# Altium schematic sheet DCDC_int.SchDoc
size 420 x 297 mm; Address1: Address1; Address2: Address2; Address3: Address3; Address4: Address4; SheetNumber: 1; Scale: 1:1; Разраб.: Иванов; Обозначение документа: АБВГ.123456.001 Э3; Пров.: Петров; Утв.: Сидоров; Наименование организации: ОАО "Концерн "МПО-Гидроприбор"; Перв. применение: АБВГ.123456.000; Наименование изделия 1: Плата; Наименование изделия 2: Схема электрическая; Наименование изделия 3: принципиальная; Нач. отд.: Нач. отд.; Фамилия нач. отд.: Сидоров
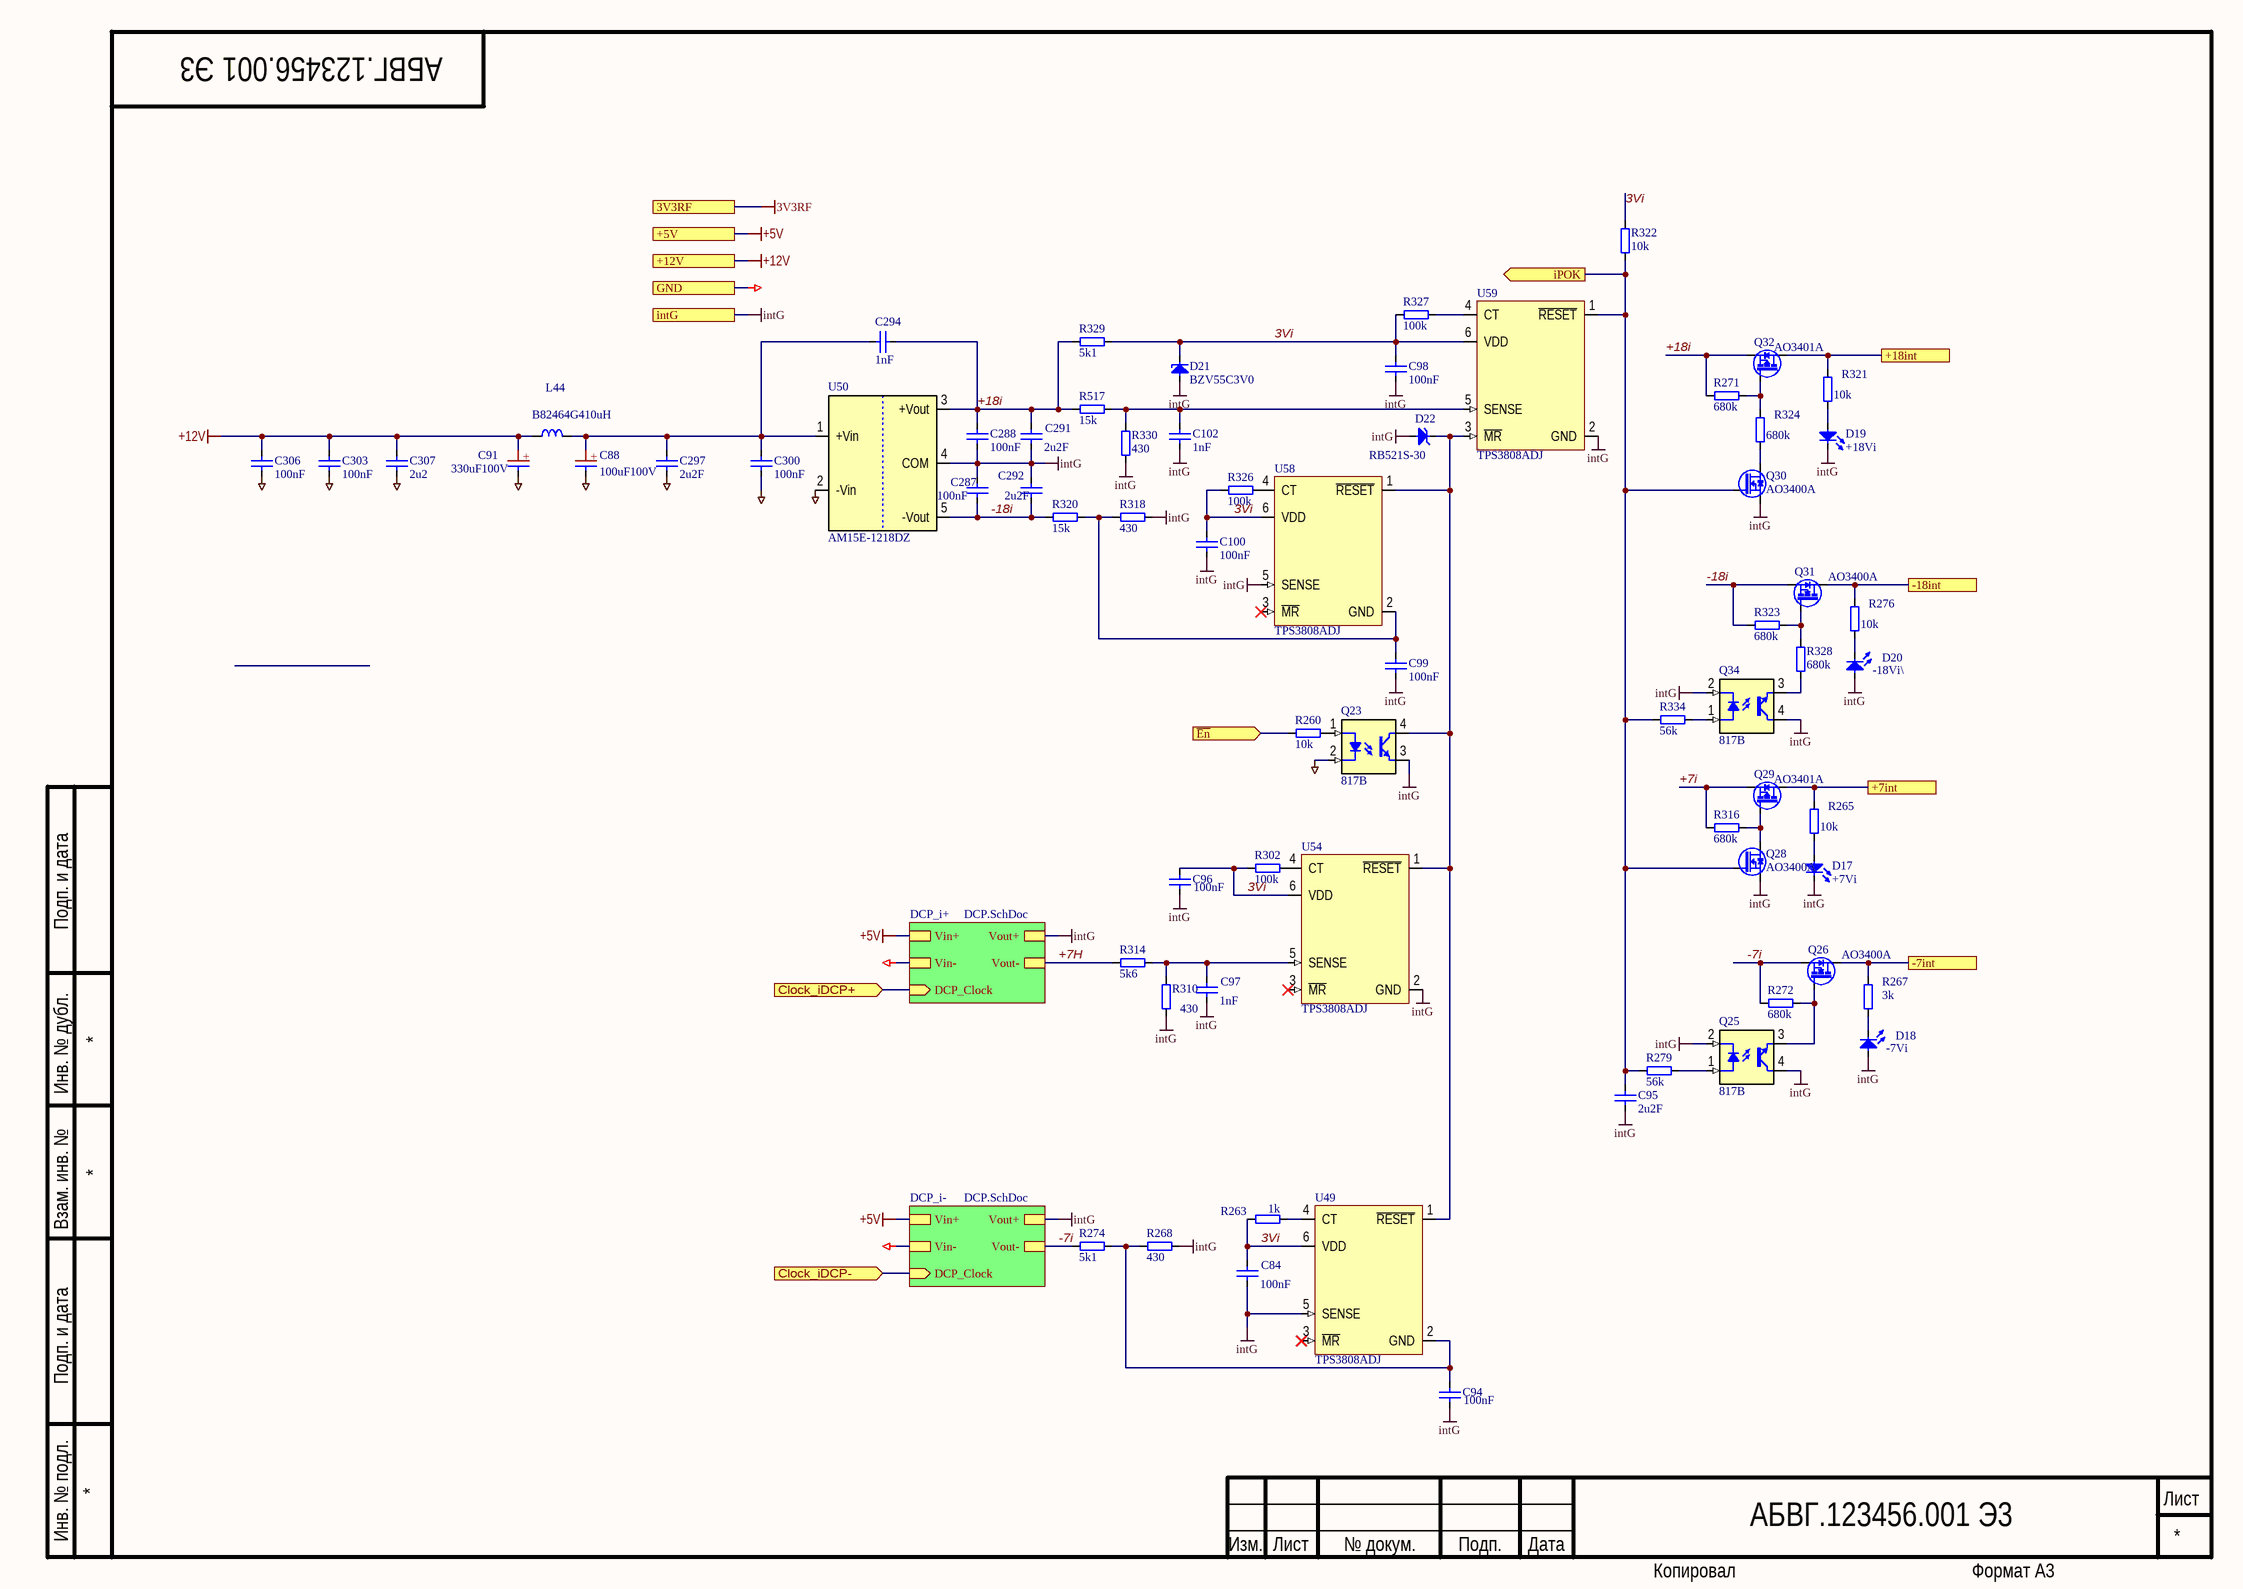
[diagram p0: DCDC_int.SchDoc]

## Parts
C84  100nF  [SMD0805CAP]
C88  100uF100V  [CAPPR500-1000X1250]
C91  330uF100V  [CAPPR750-1600X2000]
C94  100nF  [SMD0805CAP]
C95  2u2F  [SMD0805CAP]
C96  100nF  [SMD0805CAP]
C97  1nF  [SMD0805CAP]
C98  100nF  [SMD0805CAP]
C99  100nF  [SMD0805CAP]
C100  100nF  [SMD0805CAP]
C102  1nF  [SMD0805CAP]
C287  100nF  [SMD0805CAP]
C288  100nF  [SMD0805CAP]
C291  2u2F  [SMD0805CAP]
C292  2u2F  [SMD0805CAP]
C294  1nF  [SMD0805CAP]
C297  2u2F  [SMD0805CAP]
C300  100nF  [SMD0805CAP]
C303  100nF  [SMD0805CAP]
C306  100nF  [SMD0805CAP]
C307  2u2  [SMD0805CAP]
D17  +7Vi  [LED0603]
D18  -7Vi  [LED0603]
D19  +18Vi  [LED0603]
D20  -18Vi\  [LED0603]
D21  BZV55C3V0  [DIOMELF3516N]
D22  RB521S-30  [SODFL1608X65N]
L44  B82464G410uH  [IND_COILCRAFT_MSS1038]
Q23  817B  [DIP4-300]
Q25  817B  [DIP4-300]
Q26  AO3400A  [SOT95P229X119-3N]
Q28  AO3400A  [SOT95P229X119-3N]
Q29  AO3401A  [SOT95P229X119-3N]
Q30  AO3400A  [SOT95P229X119-3N]
Q31  AO3400A  [SOT95P229X119-3N]
Q32  AO3401A  [SOT95P229X119-3N]
Q34  817B  [DIP4-300]
R260  10k  [SMD0805RES]
R263  1k  [SMD0805RES]
R265  10k  [SMD0805RES]
R267  3k  [SMD0805RES]
R268  430  [SMD0805RES]
R271  680k  [SMD0805RES]
R272  680k  [SMD0805RES]
R274  5k1  [SMD0805RES]
R276  10k  [SMD0805RES]
R279  56k  [SMD0805RES]
R302  100k  [SMD0805RES]
R310  430  [SMD0805RES]
R314  5k6  [SMD0805RES]
R316  680k  [SMD0805RES]
R318  430  [SMD0805RES]
R320  15k  [SMD0805RES]
R321  10k  [SMD0805RES]
R322  10k  [SMD0805RES]
R323  680k  [SMD0805RES]
R324  680k  [SMD0805RES]
R326  100k  [SMD0805RES]
R327  100k  [SMD0805RES]
R328  680k  [SMD0805RES]
R329  5k1  [SMD0805RES]
R330  430  [SMD0805RES]
R334  56k  [SMD0805RES]
R517  15k  [SMD0805RES]
U49  TPS3808ADJ  [SOT95P270X145-6N]
U50  AM15E-1218DZ  [DCDC_Aimtec_Dual]
U54  TPS3808ADJ  [SOT95P270X145-6N]
U58  TPS3808ADJ  [SOT95P270X145-6N]
U59  TPS3808ADJ  [SOT95P270X145-6N]

## Sub-sheets
DCP_i+ = DCP.SchDoc: DCP_Clock (in), Vout+, Vout-, Vin-, Vin+
DCP_i- = DCP.SchDoc: DCP_Clock (in), Vout+, Vout-, Vin-, Vin+

## Ports
3V3RF, +5V, +7int, +12V, +18int, -7int, -18int, Clock_iDCP+ (in), Clock_iDCP- (in), GND, intG, iPOK (out), ~{En} (in)

## Nets
3V3RF: port 3V3RF
+5V: port +5V, sheet DCP_i-/Vin+, sheet DCP_i+/Vin+
+12V: C91.1(+) C303.2 C306.2 C307.2 L44.1 ; port +12V
GND: C88.2 C91.2 C297.1 C300.1 C303.1 C306.1 C307.1 Q23.2(C) U50.2(-Vin) ; port GND, sheet DCP_i-/Vin-, sheet DCP_i+/Vin-
intG: C84.1 C94.1 C95.2 C96.1 C97.1 C98.1 C99.2 C100.2 C102.1 C287.1 C288.2 C291.1 C292.2 D17.1(C) D18.2(A) D19.1(C) D20.2(A) D21.2(A) D22.2(A) Q23.3(E) Q25.2(C) Q25.4(C) Q28.2(S) Q30.2(S) Q34.2(C) Q34.4(C) R268.2 R310.2 R318.2 R330.2 U49.5(SENSE) U50.4(COM) U54.2(GND) U58.5(SENSE) U59.2(GND) ; port intG, sheet DCP_i-/Vout+, sheet DCP_i+/Vout+
3Vi: C84.2 C96.2 C98.2 C100.1 D21.1(C) R263.1 R302.1 R322.1 R326.1 R327.1 R329.1 U49.6(VDD) U54.6(VDD) U58.6(VDD) U59.6(VDD)
+7H: R314.2 ; sheet DCP_i+/Vout-
+7i: Q29.2(S) R316.2
+7int: Q29.3(D) R265.2 ; port +7int
+18i: C288.1 C291.2 C294.2 Q32.2(S) R271.2 R329.2 R517.2 U50.3(+Vout)
+18int: Q32.3(D) R321.2 ; port +18int
-7i: Q26.2(S) R272.2 R274.2 ; sheet DCP_i-/Vout-
-7int: Q26.3(D) R267.2 ; port -7int
-18i: C287.2 C292.1 Q31.2(S) R320.1 R323.2 U50.5(-Vout)
-18int: Q31.3(D) R276.2 ; port -18int
~{En}: R260.1 ; port ~{En}
Clock_iDCP+: port Clock_iDCP+, sheet DCP_i+/DCP_Clock
Clock_iDCP-: port Clock_iDCP-, sheet DCP_i-/DCP_Clock
iPOK: C95.1 Q28.1(G) Q30.1(G) R279.1 R322.2 R334.1 U59.1(~{RESET}) ; port iPOK
NetC88_1: C88.1(+) C294.1 C297.2 C300.2 L44.2 U50.1(+Vin)
NetC94_2: C94.2 R268.1 R274.1 U49.2(GND)
NetC97_2: C97.2 R310.1 R314.1 U54.5(SENSE)
NetC99_1: C99.1 R318.1 R320.2 U58.2(GND)
NetC102_2: C102.2 R330.1 R517.1 U59.5(SENSE)
NetD17_2: D17.2(A) R265.1
NetD18_1: D18.1(C) R267.1
NetD19_2: D19.2(A) R321.1
NetD20_1: D20.1(C) R276.1
NetD22_1: D22.1(C) Q23.4(C) U49.1(~{RESET}) U54.1(~{RESET}) U58.1(~{RESET}) U59.3(~{MR})
NetQ23_1: Q23.1(A) R260.2
NetQ25_1: Q25.1(A) R279.2
NetQ25_3: Q25.3(E) Q26.1(G) R272.1
NetQ28_3: Q28.3(D) Q29.1(G) R316.1
NetQ30_3: Q30.3(D) R324.1
NetQ31_1: Q31.1(G) R323.1 R328.2
NetQ32_1: Q32.1(G) R271.1 R324.2
NetQ34_1: Q34.1(A) R334.2
NetQ34_3: Q34.3(E) R328.1
NetR263_2: R263.2 U49.4(CT)
NetR302_2: R302.2 U54.4(CT)
NetR326_2: R326.2 U58.4(CT)
NetR327_2: R327.2 U59.4(CT)

Not connected (* = marked no-connect by the designer): U49 3(~{MR})*; U54 3(~{MR})*; U58 3(~{MR})*

## Notes on the sheet
- Подп. и дата
- Инв. № дубл.
- Взам. инв. №
- Инв. № подл.
- Изм.
- Лист
- № докум.
- Подп.
- Дата
- Копировал
- Формат А3

## Library data of the parts
C84 C94-C100 C102 C287 C288 C291 C292 C294 C297 C300 C303 C306 C307 = C0805: Чип конденсатор 0805; Voltage: 25V; Vendor: Vishay; DielectricType: X5R; SMD Solders: 2; Solder Option: RM; Tolerance: 20%; Pkg: SMD0805; Device: Cap0805; Price: 2
  C84 C94 C96 C98-C100 C287 C288 C300 C303 C306: Value: 100nF
  C95 C291 C292 C297: Value: 2u2F
  C97 C102 C294: Value: 1nF
  C307: Value: 2u2
C88 = CAP_POL_5x10: Конденсатор полярный d10 p5мм; Voltage: 100V; Vendor: Vishay; Value: 100uF; SMD Solders: 0; Solder Option: RM; Tolerance: 20%; Pkg: 5x10mm; Device: Cap+; THD Solders: 2; Price: 20
C91 = CAP_POL_7_5x16: Конденсатор полярный d16 p7.5мм; Voltage: 100V; Vendor: Vishay; Value: 330uF; SMD Solders: 0; Solder Option: RM; Tolerance: 20%; Pkg: 7.5x16mm; Device: Cap+; THD Solders: 2; Price: 30
D17-D20 = LED0603: Чип светодиод 0603; Vendor: KB; SMD Solders: 2; Solder Option: RM; Pkg: SMD0603; Price: 10; Device: LED0603
  D17: Value: +7Vi
  D18: Value: -7Vi
  D19: Value: +18Vi
  D20: Value: -18Vi\
D21 = BZV55C: Чип cтабилитрон; Vendor: LGE; Value: 3V0; Voltage: 3V; SMD Solders: 2; Solder Option: RM; Pkg: SOD80; Current: 5; Price: 5; Device: BZV55C; Name to order: BZV55C3V0
D22 = RB521S-30: Чип Шоттки диод; Vendor: CTK; Voltage: 30V; SMD Solders: 2; Solder Option: RM; Pkg: SOD523; Price: 5; Device: RB521S-30; Name to order: RB521S-30
L44 = B82464G4: SMD Дроссель; Vendor: Epcos; Value: 10uH; Voltage: 2; Solder Option: RM; Tolerance: 20%; Pkg: SMD10.4x10.4mm; THD Solders: 0; Name to order: B82464G4103M; Current: 3A5; Price: 400; SMD Solders: 2; Device: B82464G4
Q23 Q25 Q34 = 817B: Optotransistor; Pkg: DIP4; SMD Solders: 0; Solder Option: RM; THD Solders: 4; Vendor: UMW; Voltage: 35V; Device: 817B; Price: 10; Name to order: 817B; Current: 0
Q26 Q28 Q30 Q31 = AO3400A: NMOS; Vendor: UMW; Pkg: SOT23; SMD Solders: 3; Solder Option: RM; Voltage: 30V; Price: 10; Device: AO3400A; Name to order: AO3400A
Q29 Q32 = AO3401A: PMOS; Vendor: UMW; Pkg: SOT23; SMD Solders: 3; Solder Option: RM; THD Solders: 0; Voltage: -30V; Price: 10; Device: AO3401A; Name to order: AO3401A
R260 R263 R265 R267 R268 R271 R272 R274 R276 R279 R302 R310 R314 R316 R318 R320-R324 R326-R330 R334 R517 = R0805: Чип резистор 0805; Vendor: Vishay; SMD Solders: 2; Solder Option: RM; TC: 100ppm/C; Tolerance: 1%; Pkg: SMD0805; Pwr: 125mW; Device: Res0805; Price: 2
  R260 R265 R276 R321 R322: Value: 10k
  R263: Value: 1k
  R267: Value: 3k
  R268 R310 R318 R330: Value: 430
  R271 R272 R316 R323 R324 R328: Value: 680k
  R274 R329: Value: 5k1
  R279 R334: Value: 56k
  R302 R326 R327: Value: 100k
  R314: Value: 5k6
  R320 R517: Value: 15k
U49 U54 U58 U59 = TPS3808: Supervisory Circuit. Low-Quiescent-Current, Programmable-Delay; Vendor: Texas Instruments; Value: ADJ; Pkg: SOT23-6; SMD Solders: 6; Solder Option: RM; THD Solders: 0; Name to order: TPS3808G01DBV; Current: 6uA; thVoltage: 400mV; Price: 200; Device: TPS3808
U50 = AM15E-: DC-DC+&-Halvoisolated out; Vendor: Aimtec; Value: 1218DZ; Pkg: DCDC_5; SMD Solders: 0; Solder Option: RM; THD Solders: 5; Name to order: AM15-1218DZ; Price: 2000; Device: AM15E-